# EAGLE design dsc (EAGLE 6.3)
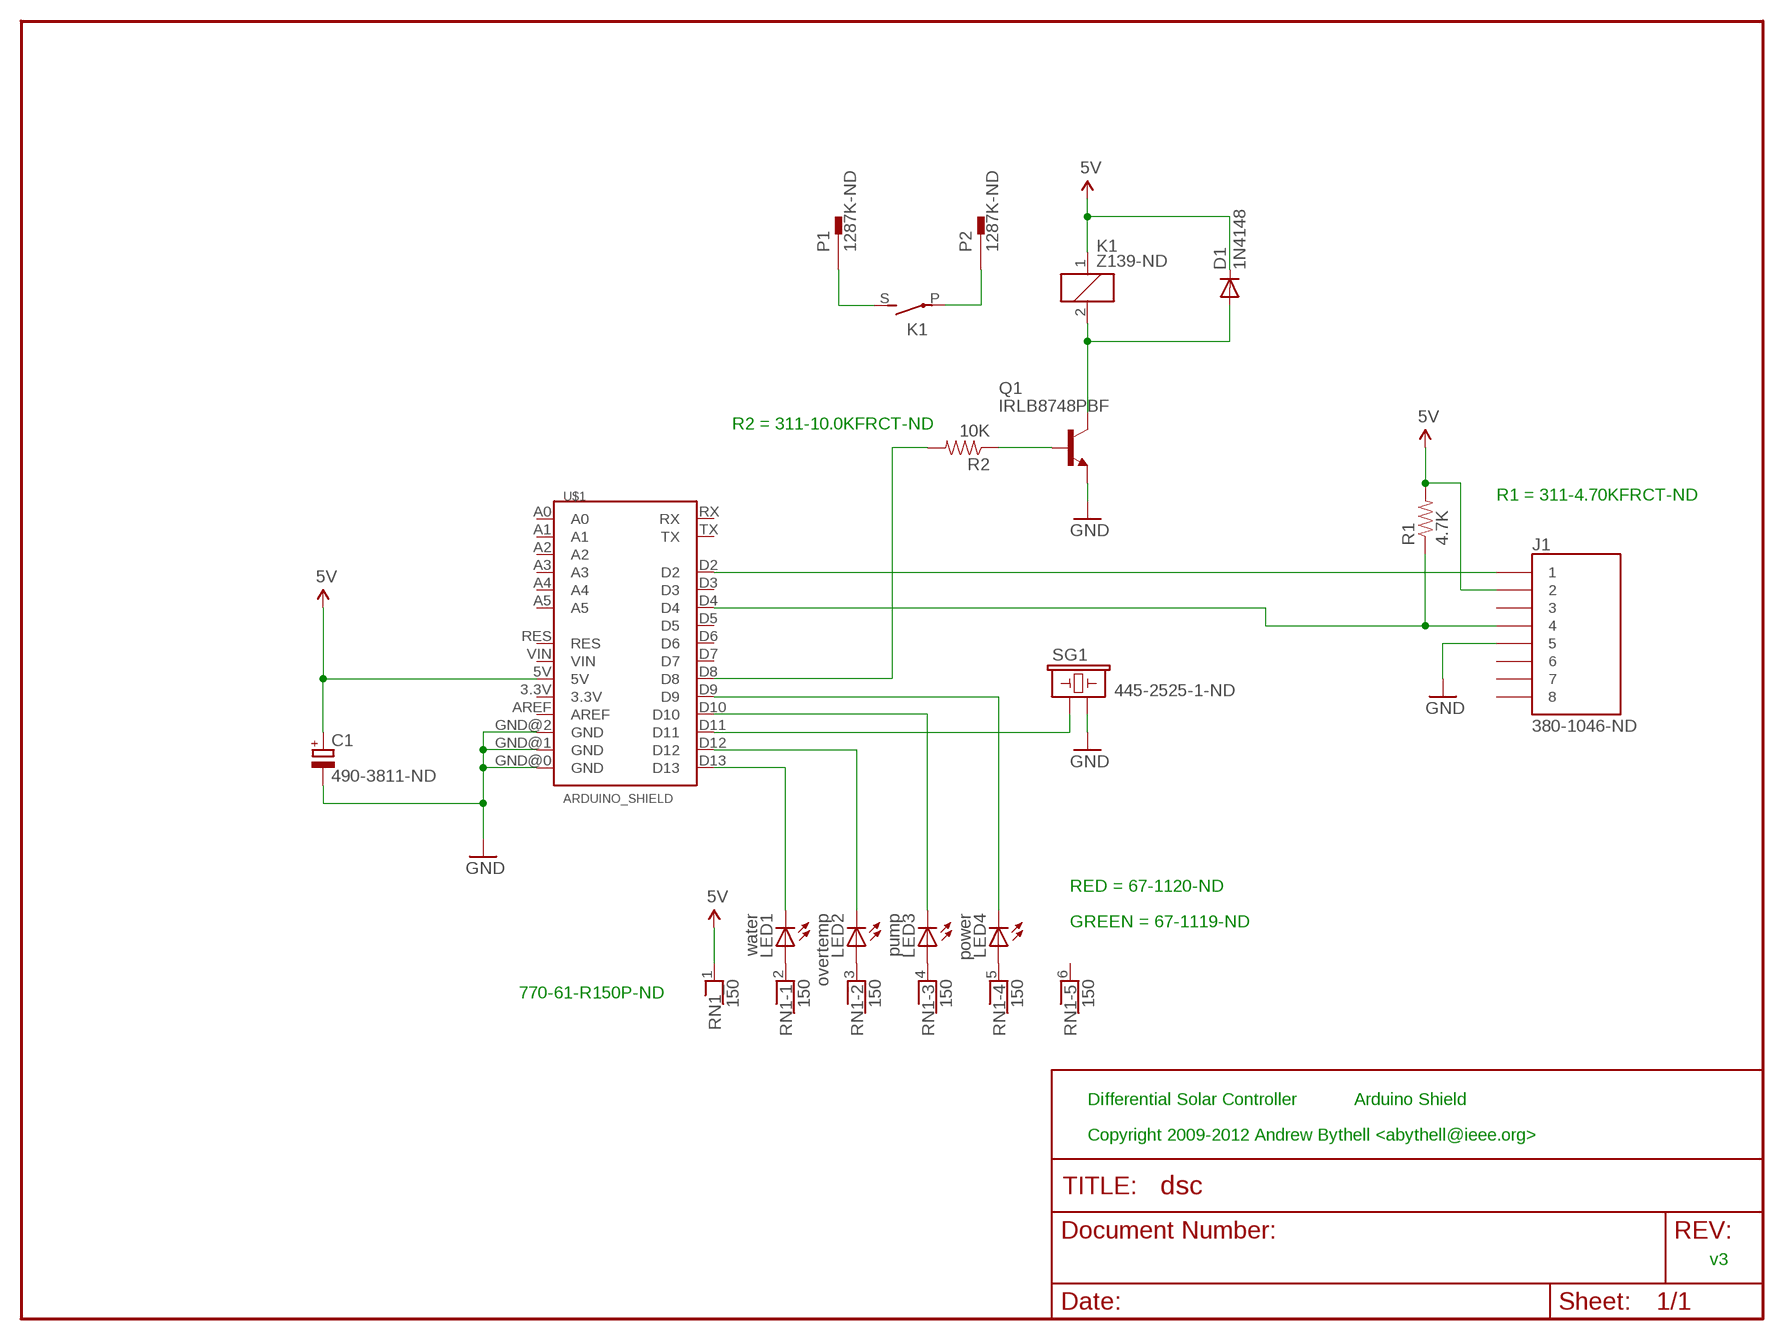
[diagram p0: schematic, sheet 1]

## Parts
C1  490-3811-ND  CPOL-EUE3.5-8  [E3,5-8]
D1  1N4148  1N4148DO35-10  [DO35-10]
J1  380-1046-ND  RJ45-8PTH  [RJ45-8]
K1  Z139-ND  G2RA  [G2RA]
LED1  water  LED5MM  [LED5MM]
LED2  overtemp  LED5MM  [LED5MM]
LED3  pump  LED5MM  [LED5MM]
LED4  power  LED5MM  [LED5MM]
P1  1287K-ND  PIN2F061.100  [F061.100]
P2  1287K-ND  PIN2F061.100  [F061.100]
Q1  IRLB8748PBF  2N2222  [TO18]
R1  4.7K  RESISTOR1206  [1206]
R2  10K  RESISTOR1206  [1206]
RN1  150  RNX5  [RN-6]
SG1  445-2525-1-ND  BUZZER  [BUZZER-12MM-AB]
U$1  ARDUINO_SHIELD  [DUEMILANOVE_SHIELD]

## Nets
5V: C1.+ D1.C J1.2 K1.1 R1.2 RN1.1 U$1.5V
ERASE: J1.4 R1.1 U$1.D4
GND: C1.- J1.5 Q1.1(E) SG1.- U$1.GND@0(GND) U$1.GND@1(GND) U$1.GND@2(GND)
N$1: Q1.2(B) R2.1
N$2: R2.2 U$1.D8
N$3: D1.A K1.2 Q1.3(C)
N$4: LED1.A RN1.2
N$5: LED2.A RN1.3
N$6: LED3.A RN1.4
N$7: LED4.A RN1.5
N$8: LED1.K(C) U$1.D13
N$9: LED2.K(C) U$1.D12
N$10: LED3.K(C) U$1.D10
N$11: LED4.K(C) U$1.D9
N$12: SG1.+ U$1.D11
N$13: K1.S(2:S) P1.A1 P1.A2
N$14: K1.P(2:P) P2.A1 P2.A2
N$15: J1.1 U$1.D2
Unconnected: J1.3 J1.6 J1.7 J1.8 RN1.6 U$1.3.3V U$1.A0 U$1.A1 U$1.A2 U$1.A3 U$1.A4 U$1.A5 U$1.AREF U$1.D3 U$1.D5 U$1.D6 U$1.D7 U$1.RES U$1.RX U$1.TX U$1.VIN

## Notes on the sheet
- R2 = 311-10.0KFRCT-ND
- R1 = 311-4.70KFRCT-ND
- RED = 67-1120-ND
- GREEN = 67-1119-ND
- 770-61-R150P-ND
- Differential Solar Controller | Arduino Shield
- Copyright 2009-2012 Andrew Bythell <abythell@ieee.org>
- v3

## Library data of the parts
C1 = rcl:CPOL-EU: POLARIZED CAPACITOR, European symbol
D1 = diode:1N4148: DIODE high speed (Philips)
J1 = SparkFun:RJ45-8: RJ45 Jack Simple RJ45, 8-pin connection - connector for common Cat5, Cat5e, and Cat6 Ethernet cables. Footprint not yet proven in production. Connector sku is PRT-00643; Breakout PCB sku is BOB-00716.
K1 = relay:G2RA: RELAY 1 x norm. open, Omron
LED1-LED4 = led:LED: LED OSRAM: - CHIPLED LG R971, LG N971, LY N971, LG Q971, LY Q971, LO R971, LY R971 LH N974, LH R974 LS Q976, LO Q976, LY Q976 LO Q996 - Hyper CHIPLED LW Q18S LB Q993, LB Q99A, LB R99A - SideLED LS A670, LO A670, LY A670, LG A670, LP A670 LB A673, LV A673, LT A673, LW A673 LH A674 LY A675 LS A676, LA A676, LO A676, LY A676, LW A676 LS A679, LY A679, LG A679 - Hyper Micro SIDELED® LS Y876, LA Y876, LO Y876, LY Y876 LT Y87S - SmartLED LW L88C, LW L88S LB L89C, LB L89S, LG L890 LS L89K, LO L89K, LY L89K LS L896, LA L896, LO L896, LY L896 - TOPLED LS T670, LO T670, LY T670, LG T670, LP T670 LSG T670, LSP T670, LSY T670, LOP T670, LYG T670 LG T671, LOG T671, LSG T671 LB T673, LV T673, LT T673, LW T673 LH T674 LS T676, LA T676, LO T676, LY T676, LB T676, LH T676, LSB T676, LW T676 LB T67C, LV T67C, LT T67C, LS T67K, LO T67K, LY T67K, LW E67C LS E67B, LA E67B, LO E67B, LY E67B, LB E67C, LV E67C, LT E67C LW T67C LS T679, LY T679, LG T679 LS T770, LO T770, LY T770, LG T770, LP T770 LB T773, LV T773, LT T773, LW T773 LH T774 LS E675, LA E675, LY E675, LS T675 LS T776, LA T776, LO T776, LY T776, LB T776 LHGB T686 LT T68C, LB T68C - Hyper Mini TOPLED® LB M676 - Mini TOPLED Santana® LG M470 LS M47K, LO M47K, LY M47K Source: http://www.osram.convergy.de LUXEON: - LUMILED® LXK2-PW12-R00, LXK2-PW12-S00, LXK2-PW14-U00, LXK2-PW14-V00 LXK2-PM12-R00, LXK2-PM12-S00, LXK2-PM14-U00 LXK2-PE12-Q00, LXK2-PE12-R00, LXK2-PE12-S00, LXK2-PE14-T00, LXK2-PE14-U00 LXK2-PB12-K00, LXK2-PB12-L00, LXK2-PB12-M00, LXK2-PB14-N00, LXK2-PB14-P00, LXK2-PB14-Q00 LXK2-PR12-L00, LXK2-PR12-M00, LXK2-PR14-Q00, LXK2-PR14-R00 LXK2-PD12-Q00, LXK2-PD12-R00, LXK2-PD12-S00 LXK2-PH12-R00, LXK2-PH12-S00 LXK2-PL12-P00, LXK2-PL12-Q00, LXK2-PL12-R00 Source: www.luxeon.com KINGBRIGHT: KA-3528ASYC Source: www.kingbright.com
P1 P2 = con-faston:PIN2: Flachstecker Typ Tyco/Electronics/AMP TAB, FASTON Printed Circuit Board Tabs Source: http://www.buerklin.com, http://catalog.tycoelectronics.com; OC_FARNELL: unknown; OC_NEWARK: unknown
Q1 = transistor:2N2222: NPN TRANSISTOR
R1 R2 = SparkFun:RESISTOR: Resistor Basic schematic elements and footprints for 0603, 1206, and PTH 1/10th watt (small) resistors.
RN1 = resistor-net:RNX5: RESISTOR NETWORK
SG1 = SparkFun:BUZZER: Buzzer 12mm Spark Fun Electronics SKU : Comp-Buzzer
U$1 = SparkFun:ARDUINO_SHIELD

## Board
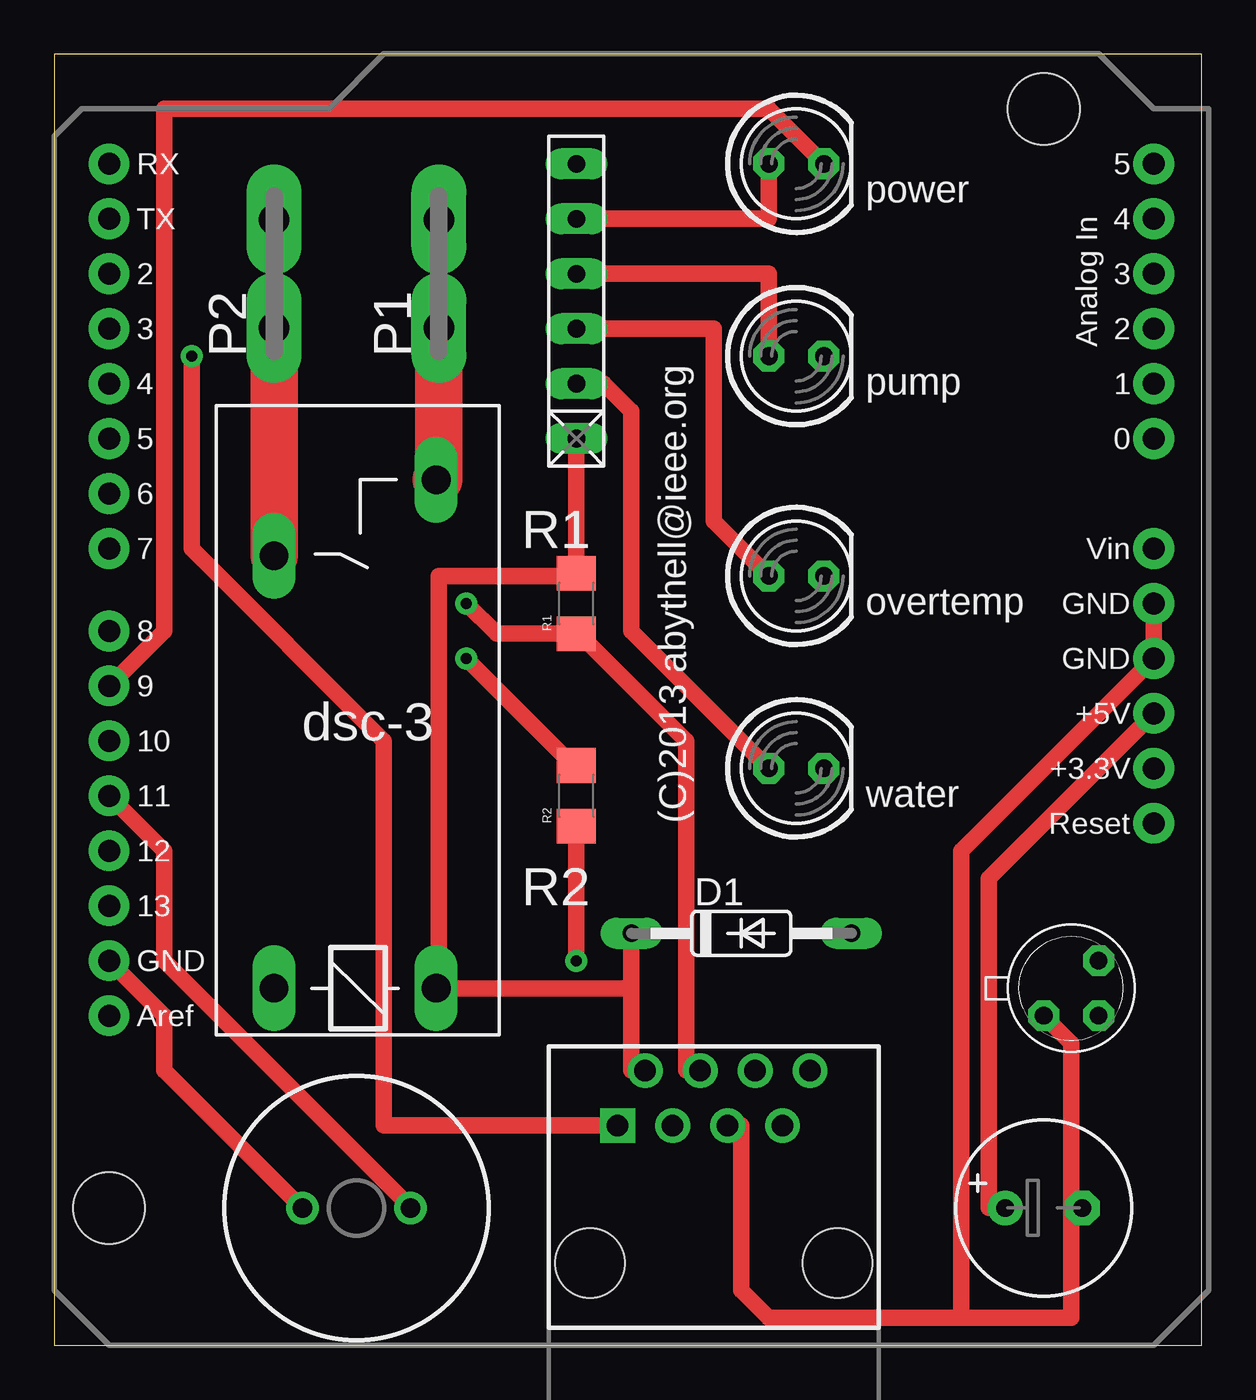
[diagram p1: board, top side]
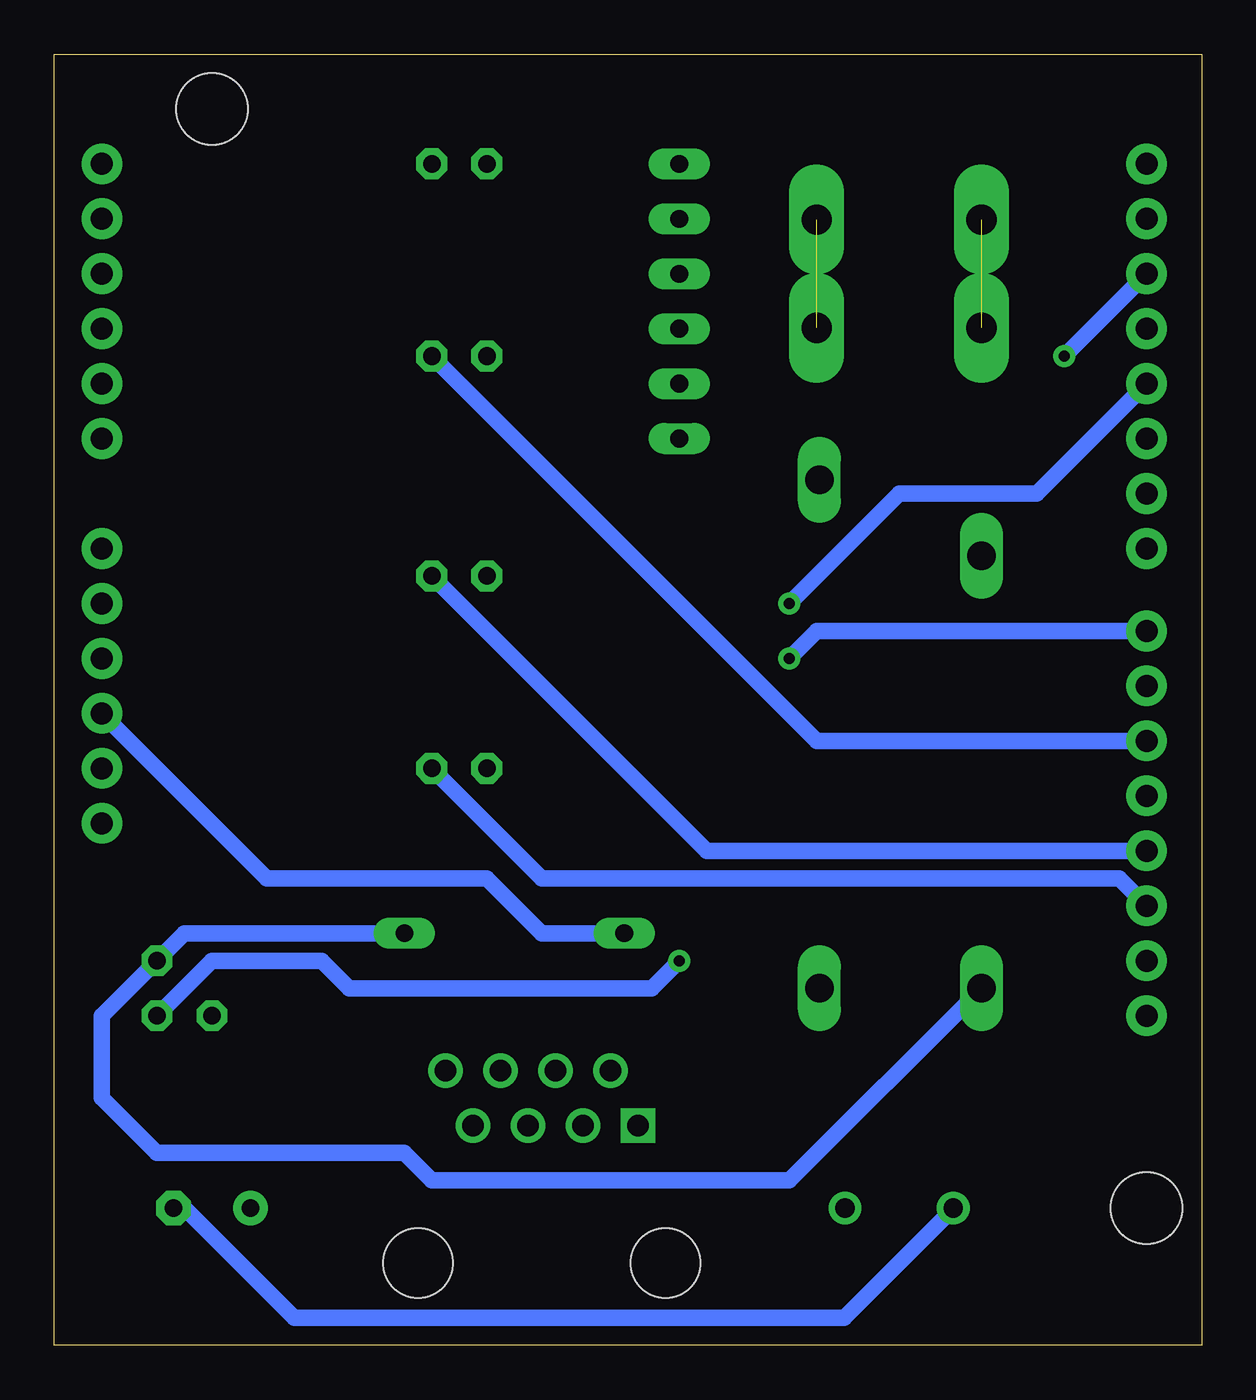
[diagram p2: board, bottom side, seen from below]

Size 53.01 x 59.68 mm. Coordinates in mm from the lower left corner, seen from the top.
Outline: 0,0 53.01,0 53.01,59.68 0,59.68 0,0
Copper layers (1*16): Top 0.035mm / dielectric 1.5mm / Bottom 0.035mm
Design rules "SparkFun": minimum track width 8mil, minimum drill 20mil, track to track 8mil, track to pad 8mil, pad to pad 8mil, via to via 8mil, smd to smd 8mil, copper to edge 10mil, drill to drill 8mil, minimum pad ring 12mil, minimum via ring 10mil, stop-mask expansion 4mil, vias tented up to drill 25mil, thermal gap 10mil

### Footprints (pad centres in the part's own frame; a part is rotated, then mirrored left to right if it is on the bottom)
E3,5-8 = drill 0.813 pad 1.6: + -1.778,0 | drill 0.813 pad 1.6 octagon: - 1.778,0
DO35-10 = drill 0.813 long: A 5.08,0; C -5.08,0
RJ45-8 = drill 1 square: 1 -4.445,6.35 | drill 1: 2 -3.175,8.89; 3 -1.905,6.35; 4 -0.635,8.89; 5 0.635,6.35; 6 1.905,8.89; 7 3.175,6.35; 8 4.445,8.89 | hole 3.2: -5.715,0; 5.715,0
G2RA = drill 1.321 long: 1 -3.81,-3.683; 2 -3.81,3.81; P 16.18,3.81; S 19.685,-3.683
LED5MM = drill 0.813 octagon: A -1.27,0; K 1.27,0
F061.100 = drill 1.4 pad 2.54 long: A1 -2.5,0; A2 2.5,0
TO18 = drill 0.813 octagon: 1 -1.27,-1.27; 2 1.27,-1.27; 3 1.27,1.27
1206 = smd 1.6 x 1.8: 1 -1.4,0; 2 1.4,0
RN-6 = drill 0.813 long: 1 -6.35,0; 2 -3.81,0; 3 -1.27,0; 4 1.27,0; 5 3.81,0; 6 6.35,0
BUZZER-12MM-AB = drill 0.9: + 2.5,0; - -2.5,0
DUEMILANOVE_SHIELD = drill 1.016 pad 1.88: 3.3V 50.8,26.67; 5V 50.8,29.21; A0 50.8,41.91; A1 50.8,44.45; A2 50.8,46.99; A3 50.8,49.53; A4 50.8,52.07; A5 50.8,54.61; AREF 2.54,15.24; D2 2.54,49.53; D3 2.54,46.99; D4 2.54,44.45; D5 2.54,41.91; D6 2.54,39.37; D7 2.54,36.83; D8 2.54,33.02; D9 2.54,30.48; D10 2.54,27.94; D11 2.54,25.4; D12 2.54,22.86; D13 2.54,20.32; GND@0 50.8,31.75; GND@1 50.8,34.29; GND@2 2.54,17.78; RES 50.8,24.13; RX 2.54,54.61; TX 2.54,52.07; VIN 50.8,36.83 | hole 3.302: 45.72,57.15; 2.54,6.35

### Placement (x,y rotation side)
C1  45.72,6.35 0 top
D1  31.75,19.05 0 top
J1  30.48,3.81 0 top
K1  13.97,20.32 90 top
LED1  34.29,26.67 0 top
LED2  34.29,35.56 0 top
LED3  34.29,45.72 0 top
LED4  34.29,54.61 0 top
P1  17.78,49.53 90 top
P2  10.16,49.53 90 top
Q1  46.99,16.51 0 top
R1  24.13,34.29 90 top
R2  24.13,25.4 90 top
RN1  24.13,48.26 90 top
SG1  13.97,6.35 0 top
U$1  0,0 0 top

### Tracks (layer width: path | path; a pad name or v marks a point on that pad's centre or on a via)
5V
  Top 0.762: RN1.1 R1.2 24.13,35.56 17.78,35.56 17.78,16.51 | 26.67,16.51 26.67,12.7 J1.2 | 26.67,16.51 D1.C | 17.78,16.51 26.67,16.51 | K1.1 17.78,16.51 | U$1.5V 43.18,21.59 43.18,6.35 C1.+
  Bottom 0.762: U$1.5V 43.18,21.59 33.02,21.59 30.48,19.05 D1.C
ERASE  (via drill 0.51)
  Top 0.762: J1.4 29.21,12.7 29.21,27.94 24.13,33.02 R1.1 20.45,32.89 v19.05,34.29
  Bottom 0.762: U$1.D4 7.62,39.37 13.97,39.37 v19.05,34.29
GND
  Top 0.762: U$1.GND@2 5.08,15.24 5.08,12.7 11.43,6.35 SG1.- | U$1.GND@1 U$1.GND@0 41.91,22.86 41.91,1.27 | Q1.1 46.99,13.97 46.99,6.35 | 41.91,1.27 46.99,1.27 46.99,6.35 | 41.91,1.27 33.02,1.27 31.75,2.54 31.75,10.16 J1.5 | C1.- 46.99,6.35
  Bottom 0.762: SG1.- 11.43,6.35 16.51,1.27 41.91,1.27 46.99,6.35 C1.-
N$1  (via drill 0.51)
  Top 0.762: v24.13,17.78 R2.1 24.13,24.13
  Bottom 0.762: v24.13,17.78 25.4,16.51 39.37,16.51 40.64,17.78 45.72,17.78 Q1.2
N$2  (via drill 0.51)
  Top 0.762: v19.05,31.75 24.13,26.67 R2.2
  Bottom 0.762: v19.05,31.75 17.78,33.02 U$1.D8
N$3
  Bottom 0.762: D1.A 46.99,19.05 Q1.3 50.8,15.24 50.8,11.43 48.26,8.89 36.83,8.89 35.56,7.62 19.05,7.62 K1.2
N$4
  Top 0.762: LED1.A 26.67,33.02 26.67,43.18 25.4,44.45 RN1.2
N$5
  Top 0.762: RN1.3 30.48,46.99 30.48,38.1 LED2.A
N$6
  Top 0.762: RN1.4 33.02,49.53 LED3.A
N$7
  Top 0.762: RN1.5 33.02,52.07 LED4.A
N$8
  Bottom 0.762: LED1.K 30.48,21.59 3.81,21.59 U$1.D13
N$9
  Bottom 0.762: LED2.K 22.86,22.86 U$1.D12
N$10
  Bottom 0.762: LED3.K 17.78,27.94 U$1.D10
N$11
  Top 0.762: LED4.K 33.02,57.15 5.08,57.15 5.08,33.02 U$1.D9
N$12
  Top 0.762: U$1.D11 5.08,22.86 5.08,17.78 16.51,6.35 SG1.+
N$13  (1 unrouted)
  Top 2.184: K1.S 17.78,40.01 P1.A1
N$14  (1 unrouted)
  Top 2.184: K1.P P2.A1
N$15  (via drill 0.51)
  Top 0.762: v6.35,45.72 6.35,36.83 15.24,27.94 15.24,10.16 J1.1
  Bottom 0.762: v6.35,45.72 U$1.D2

### Text on the board
tPlace: R1 | dsc-3 | (C)2013 abythell@ieee.org | R2